# Altium schematic sheet XiBank_V1.0.SchDoc
size A4
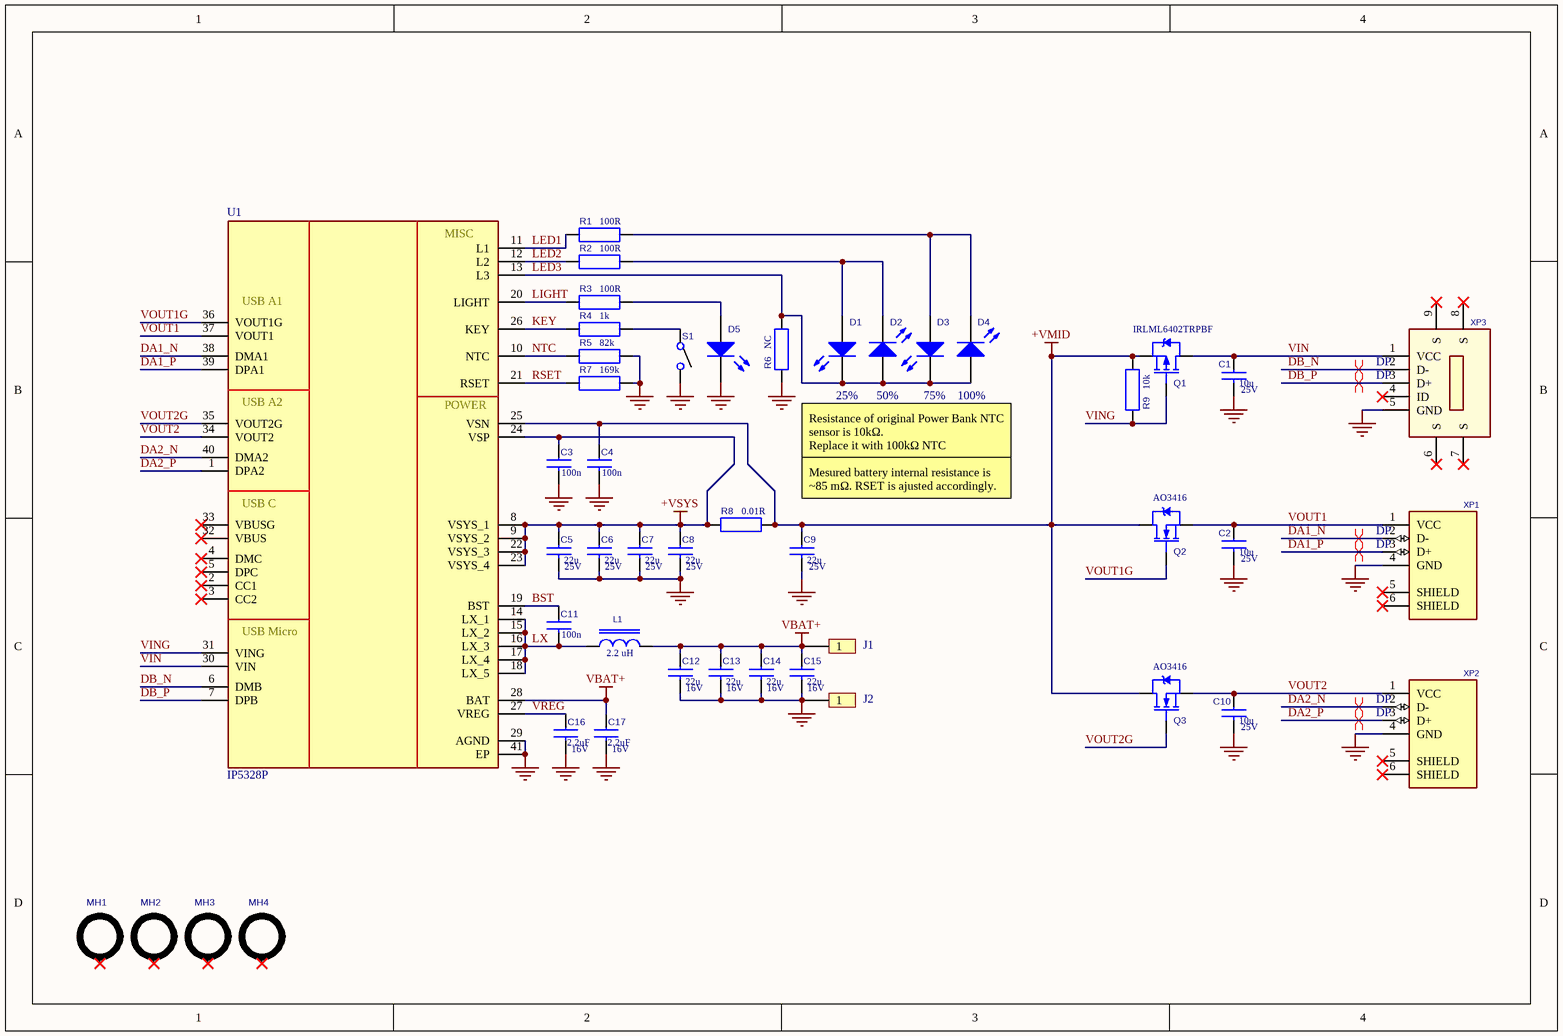
[diagram p0: XiBank_V1.0.SchDoc]

## Parts
C1  Voltage: 25V  [CC0805]  (hidden comment: 10u)
C2  Voltage: 25V  [CC0805]  (hidden comment: 10u)
C3  100n  [CC0603]
C4  100n  [CC0603]
C5  Voltage: 25V  [CC0805]  (hidden comment: 22u)
C6  Voltage: 25V  [CC0805]  (hidden comment: 22u)
C7  Voltage: 25V  [CC0805]  (hidden comment: 22u)
C8  Voltage: 25V  [CC0805]  (hidden comment: 22u)
C9  Voltage: 25V  [CC0805]  (hidden comment: 22u)
C10  Voltage: 25V  [CC0805]  (hidden comment: 10u)
C11  100n  [CC0603]
C12  Voltage: 16V  [CC0805]  (hidden comment: 22u)
C13  Voltage: 16V  [CC0805]  (hidden comment: 22u)
C14  Voltage: 16V  [CC0805]  (hidden comment: 22u)
C15  Voltage: 16V  [CC0805]  (hidden comment: 22u)
C16  Voltage: 16V  [CC0603]  (hidden comment: 2.2uF)
C17  Voltage: 16V  [CC0603]  (hidden comment: 2.2uF)
D1  LTW-C191DS5  [LED0603]  (value not drawn)
D2  LTW-C191DS5  [LED0603]  (value not drawn)
D3  LTW-C191DS5  [LED0603]  (value not drawn)
D4  LTW-C191DS5  [LED0603]  (value not drawn)
D5  LTW-C191DS5  [LED0603]  (value not drawn)
J1  Header 1pin  [1 Hole]  (value not drawn)  (no BOM)
J2  Header 1pin  [1 Hole]  (value not drawn)  (no BOM)
L1  value 2.2 uH  [HPI1040100]  (hidden comment: HPI1040-2R2)
MH1  MH_3.5_NONPLATED  [MH_3.5_NONPLATED]  (value not drawn)  (no BOM)
MH2  MH_3.5_NONPLATED  [MH_3.5_NONPLATED]  (value not drawn)  (no BOM)
MH3  MH_3.5_NONPLATED  [MH_3.5_NONPLATED]  (value not drawn)  (no BOM)
MH4  MH_3.5_NONPLATED  [MH_3.5_NONPLATED]  (value not drawn)  (no BOM)
Q1  IRLML6402TRPBF  [SOT23-3]
Q2  AO3416  [SOT23-3]
Q3  AO3416  [SOT23-3]
R1  100R  [RC0603]
R2  100R  [RC0603]
R3  100R  [RC0603]
R4  1k  [RC0603]
R5  82k  [RC0603]
R6  NC  [RC0603]
R7  169k  [RC0603]
R8  0.01R  [RC1206]
R9  10k  [RC0603]
S1  (no value)  [SW_LS10N2T_CIT]
U1  IP5328P  [QFN50P600X600X80-41N]
XP1  USB-A Conn  [0480372200]  (value not drawn)
XP2  USB-A Conn  [0480372200]  (value not drawn)
XP3  ZX80-B-5P  [10118194-0001LF]  (value not drawn)

## Nets
+VMID: C4.1 C9.1 Q1.2(S) Q2.3(D) Q3.3(D) R8.2 R9.2 U1.25(VSN)
+VSYS: C3.1 C5.1 C6.1 C7.1 C8.1 R8.1 U1.8(VSYS_1) U1.9(VSYS_2) U1.22(VSYS_3) U1.23(VSYS_4) U1.24(VSP)
GND: C1.2 C2.2 C3.2 C4.2 C5.2 C6.2 C7.2 C8.2 C9.2 C10.2 C12.2 C13.2 C14.2 C15.2 C16.2 C17.2 D5.1(K) J2.1 R5.2 R6.1 R7.2 S1.2 U1.29(AGND) U1.41(EP) XP1.4(GND) XP2.4(GND) XP3.5(GND)
VBAT+: C12.1 C13.1 C14.1 C15.1 C17.1 J1.1 L1.2 U1.28(BAT)
BST: C11.1 U1.19(BST)
DA1_N: U1.38(DMA1) XP1.2(D-)
DA1_P: U1.39(DPA1) XP1.3(D+)
DA2_N: U1.40(DMA2) XP2.2(D-)
DA2_P: U1.1(DPA2) XP2.3(D+)
DB_N: U1.6(DMB) XP3.2(D-)
DB_P: U1.7(DPB) XP3.3(D+)
KEY: R4.1 U1.26(KEY)
LED1: R1.1 U1.11(L1)
LED2: R2.1 U1.12(L2)
LED3: D1.1(K) D2.2(A) D3.1(K) D4.2(A) R6.2 U1.13(L3)
LIGHT: R3.1 U1.20(LIGHT)
LX: C11.2 L1.1 U1.14(LX_1) U1.15(LX_2) U1.16(LX_3) U1.17(LX_4) U1.18(LX_5)
NTC: R5.1 U1.10(NTC)
RSET: R7.1 U1.21(RSET)
VIN: C1.1 Q1.3(D) U1.30(VIN) XP3.1(VCC)
VING: Q1.1(G) R9.1 U1.31(VING)
VOUT1: C2.1 Q2.2(S) U1.37(VOUT1) XP1.1(VCC)
VOUT1G: Q2.1(G) U1.36(VOUT1G)
VOUT2: C10.1 Q3.2(S) U1.34(VOUT2) XP2.1(VCC)
VOUT2G: Q3.1(G) U1.35(VOUT2G)
VREG: C16.1 U1.27(VREG)
NetD1_2: D1.2(A) D2.1(K) R2.2
NetD3_2: D3.2(A) D4.1(K) R1.2
NetD5_2: D5.2(A) R3.2
NetR4_2: R4.2 S1.1

Not connected (* = marked no-connect by the designer): MH1 0*; MH2 0*; MH3 0*; MH4 0*; U1 2(CC1)* 3(CC2)* 4(DMC)* 5(DPC)* 32(VBUS)* 33(VBUSG)*; XP1 5(SHIELD)* 6(SHIELD)*; XP2 5(SHIELD)* 6(SHIELD)*; XP3 4(ID)* 6(S)* 7(S)* 8(S)* 9(S)*

## Layout directives
differential pair; ClassDiffPair: DP: DA1_N, DA1_P, DA2_N, DA2_P, DB_N, DB_P

## Notes on the sheet
- 25%
- 50%
- 75%
- 100%
- Resistance of original Power Bank NTC sensor is 10kΩ.
  Replace it with 100kΩ NTC
- Mesured battery internal resistance is
  ~85 mΩ. RSET is ajusted accordingly.
- Title:
- Number:
- Date:
- Time:
- Revision:
- Sheet
- of
- Drawn by :
- Checked by :
- Approved by :
- Variant:
- Black Nova. All Right Reserved - Copyright 2022
- (in symbol IP5328P) MISC; USB A1; USB A2; POWER; USB C; USB Micro

## Library data of the parts
C1 C2 C10 = CC0805K-X7R-10V0-10U: 10 µF ±10% 25V Ceramic Capacitor X5R 0805 (2012 Metric); Manufacturer: Samsung Electro-Mechanics; Manufacturer Part Number: CL21A106KAYNNNE; Pb Free: Yes; Case: 0805; Value: 10u; Tolerance: 10%; Temperature: -55 - +85 C; Material: X5R; Component Type: Standard; ComponentLink2Description: Datasheet; ComponentLink2URL: http://www.yageo.com/pdf/UPY-GPHC_X7R_6.3V-to-50V_3.pdf
C3 C4 C11 = CC0603K-X7R-50V0-100N: 0.1 µF ±10% 50V Ceramic Capacitor X7R 0603 (1608 Metric); Manufacturer: Samsung Electro-Mechanics; Manufacturer Part Number: CL10B104KB8NNNC; Pb Free: Yes; Case: 0603; Value: 100n; Voltage: 50V; Tolerance: 10%; Temperature: -55 - +125 C; Material: X7R; Component Type: Standard; ComponentLink2Description: Datasheet
  C3 C4: ComponentLink2URL: http://www.yageo.com/pdf/UPY-GPHC_X7R_6.3V-to-50V_3.pdf
  C11: ComponentLink2URL: https://media.digikey.com/pdf/Data%20Sheets/Samsung%20PDFs/CL10B104KB8NNNC_Spec.pdf
C5-C9 = CC0805K-X7R-10V0-10U: 22 µF ±20% 25V Ceramic Capacitor X5R 0805 (2012 Metric); Manufacturer: Samsung Electro-Mechanics; Manufacturer Part Number: CL21A226MAYNNNE; Tolerance: 10%; Pb Free: Yes; Case: 0805; Value: 22u; Temperature: -55 - +85 C; Material: X5R; Component Type: Standard; ComponentLink2Description: Datasheet
  C5-C7 C9: ComponentLink2URL: http://www.yageo.com/pdf/UPY-GPHC_X7R_6.3V-to-50V_3.pdf
  C8: ComponentLink2URL: https://media.digikey.com/pdf/Data%20Sheets/Samsung%20PDFs/CL21A226MAYNNNE_Spec.pdf
C12-C15 = CC0805K-X7R-10V0-10U: 22 µF ±20% 16V Ceramic Capacitor X5R 0805 (2012 Metric); Manufacturer: Samsung Electro-Mechanics; Manufacturer Part Number: CL21A226MOCLRNC; Tolerance: 10%; Pb Free: Yes; Case: 0805; Value: 22u; Temperature: -55 - +125 C; Material: X5R; Component Type: Standard; ComponentLink2Description: Datasheet
  C12 C13 C15: ComponentLink2URL: http://www.yageo.com/pdf/UPY-GPHC_X7R_6.3V-to-50V_3.pdf
  C14: ComponentLink2URL: https://media.digikey.com/pdf/Data%20Sheets/Samsung%20PDFs/CL21A226MOCLRNC_Spec.pdf
C16 C17 = CC0603K-X7R-50V0-100N: 2.2 µF ±10% 16V Ceramic Capacitor X5R 0603 (1608 Metric); Manufacturer: Samsung Electro-Mechanics; Manufacturer Part Number: CL10A225KO8NNNC; Pb Free: Yes; Case: 0603; Value: 2.2uF; Tolerance: 10%; Temperature: -55 - +85 C; Material: X5R; Component Type: Standard; ComponentLink2Description: Datasheet
  C16: ComponentLink2URL: http://www.yageo.com/pdf/UPY-GPHC_X7R_6.3V-to-50V_3.pdf
  C17: ComponentLink2URL: https://media.digikey.com/pdf/Data%20Sheets/Samsung%20PDFs/CL10A225KO8NNNC_Spec.pdf
D1-D5 = TLMY1000-GS08: White LED Indication - Discrete 2.93V 0603 (1608 Metric); Manufacturer: Lite-On Inc.; Current: 5mA; Color: White; Voltage: 2.93V; Manufacturer Part Number: LTW-C191DS5; Component Type: Standard; Case: LED0603; ComponentLink2Description: Datasheet
  D1 D3 D4: ComponentLink2URL: http://www.vishay.com/docs/83172/tlmo1000.pdf
  D5: ComponentLink2URL: https://optoelectronics.liteon.com/upload/download/DS22-2006-062/LTW-C191DS5.PDF
J1 J2 = HEADER_2.54_THR_1x1P_MV: THRU header 1pins, MALE, Vertical, 2.54mm pitch; Manufacturer Part Number: TSW-101-07-L-S; Pins number: 1; Pb Free: Yes; Part Number: HEADER_2.54_THR_1x1P_MV; Temperature: -40 - +105 C; Component Type: Standard; Case: HEADER_2.54_THR_1x1P_MV; ComponentLink2Description: Datasheet; ComponentLink2URL: http://suddendocs.samtec.com/catalog_english/tsw_th.pdf; Published: 02-Jan-12; Publisher: dlitvinenko; STATUS: CHECKED
L1 = PSDB1005NT681: SMD Power Inductor, 2.2uH, 12A, 6.5mΩ; Manufacturer: FERROCORE; Tolerance: 20%; Pb Free: Yes; Part Number: HPI1040-2R2; DC Current: 12A; DC Resistance: 6.5mΩ; Temperature: -55...125°C; Manufacturer Part Number: HPI1040-2R2; Component Type: Standard; Case: 10x10x3.8mm; ComponentLink2Description: Datasheet; ComponentLink2URL: http://www.viking.tw/product/PSDB.pdf; Published: 06.04.2014; Publisher: dlegkobyt; STATUS: CHECKED
MH1-MH4 = MH_3.5_NONPLATED: Mounting hole misc, non plated; Part Number: MH_3.5_NONPLATED
Q1 = IRLML6402: P-Channel 20 V 3.7A (Ta) 1.3W (Ta) Surface Mount Micro3™/SOT-23; Manufacturer: Infineon Technologies; Analogs: AO3401A, AO3415, AO3407A; Current: -3.7A; Voltage CEO: -20V; Pb Free: Yes; Marking: E6RRA; Temperature: -50 - +150 C; Manufacturer Part Number: IRLML6402TRPBF; Component Type: Standard; Case: SOT23-3; ComponentLink2Description: Datasheet; ComponentLink2URL: https://www.infineon.com/dgdl/irlml6402pbf.pdf?fileId=5546d462533600a401535668d5c2263c; Parameter 1: *
Q2 Q3 = IRLML2502GPbF: N-Channel 20 V 6.5A (Ta) 1.4W (Ta) Surface Mount SOT-23-3; Manufacturer: Alpha & Omega Semiconductor Inc.; Analogs: DMN3404L; Voltage CEO: 20V; Pb Free: Yes; Current: 6.5A; Temperature: -50 - +150 C; Manufacturer Part Number: AO3416; Component Type: Standard; Case: SOT23-3; ComponentLink2Description: Datasheet; Parameter 1: *
  Q2: ComponentLink2URL: https://media.digikey.com/pdf/Data%20Sheets/Alpha%20&%20Omega/AO3416.pdf
  Q3: ComponentLink2URL: http://www.irf.com/product-info/datasheets/data/irlml2502gpbf.pdf
R1-R3 = RC0603F-100R: 100 ±1% 0.1W, 1/10W Chip Resistor 0603 (1608 Metric) Moisture Resistant Thick Film; Manufacturer: YAGEO; Manufacturer Part Number: RC0603FR-07100RL; Voltage: 50V; Pb Free: Yes; Case: 0603; Value: 100R; Power: 1/10W; Tolerance: 1%; Temperature: -55 - +155 C; Component Type: Standard; ComponentLink2Description: Datasheet; ComponentLink2URL: http://www.yageo.com/pdf/PYu-RC0603_51_RoHS_L_4.pdf
R4 = RC0603F-1K: 1k ±1% 0.1W, 1/10W Chip Resistor 0603 (1608 Metric) Moisture Resistant Thick Film; Manufacturer: YAGEO; Manufacturer Part Number: RC0603FR-071KL; Voltage: 50V; Pb Free: Yes; Case: 0603; Value: 1k; Power: 1/10W; Tolerance: 1%; Temperature: -55 - +155 C; Component Type: Standard; ComponentLink2Description: Datasheet; ComponentLink2URL: http://www.yageo.com/pdf/PYu-RC0603_51_RoHS_L_4.pdf
R5 = RC0603F-82K: 82 kOhms ±1% 0.1W, 1/10W Chip Resistor 0603 (1608 Metric) Moisture Resistant Thick Film; Manufacturer: YAGEO; Manufacturer Part Number: RC0603FR-0782KL; Voltage: 50V; Pb Free: Yes; Case: 0603; Value: 82k; Power: 1/10W; Tolerance: 1%; Temperature: -55 - +155 C; Component Type: Standard; ComponentLink2Description: Datasheet; ComponentLink2URL: https://www.yageo.com/upload/media/product/productsearch/datasheet/rchip/PYu-RC_Group_51_RoHS_L_11.pdf
R6 = RC0603F-200K: 200k ±1% 0.1W, 1/10W Chip Resistor 0603 (1608 Metric) Moisture Resistant Thick Film; Manufacturer: YAGEO; Manufacturer Part Number: RC0603FR-07200KL; Voltage: 50V; Pb Free: Yes; Case: 0603; Value: NC; Power: 1/10W; Tolerance: 1%; Temperature: -55 - +155 C; Component Type: Standard; ComponentLink2Description: Datasheet; ComponentLink2URL: http://www.yageo.com/pdf/PYu-RC0603_51_RoHS_L_4.pdf
R7 = RC0603F-200K: 169k ±1% 0.1W, 1/10W Chip Resistor 0603 (1608 Metric) Moisture Resistant Thick Film; Manufacturer: YAGEO; Manufacturer Part Number: RC0603FR-07169KL; Voltage: 50V; Pb Free: Yes; Case: 0603; Value: 169k; Power: 1/10W; Tolerance: 1%; Temperature: -55 - +155 C; Component Type: Standard; ComponentLink2Description: Datasheet; ComponentLink2URL: http://www.yageo.com/pdf/PYu-RC0603_51_RoHS_L_4.pdf
R8 = RC1206F-0R01: 10 mOhms ±1% 0.25W, 1/4W Chip Resistor 1206 (3216 Metric) Automotive AEC-Q200, Current Sense, Moisture Resistant Thick Film; Manufacturer: YAGEO; Manufacturer Part Number: RL1206FR-070R01L; Voltage: 200V; Pb Free: Yes; Case: 1206; Value: 0.01R; Power: 1/4W; Tolerance: 1%; Temperature: -55 - +155 C; Component Type: Standard; ComponentLink2Description: Datasheet; ComponentLink2URL: https://www.yageo.com/upload/media/product/productsearch/datasheet/rchip/PYu-RL_Group_521_RoHS_L_2.pdf
R9 = RC0603F-10K: 10k ±1% 0.1W, 1/10W Chip Resistor 0603 (1608 Metric) Moisture Resistant Thick Film; Manufacturer: YAGEO; Manufacturer Part Number: RC0603FR-0710KL; Voltage: 50V; Pb Free: Yes; Case: 0603; Value: 10k; Power: 1/10W; Tolerance: 1%; Temperature: -55 - +155 C; Component Type: Standard; ComponentLink2Description: Datasheet; ComponentLink2URL: http://www.yageo.com/pdf/PYu-RC0603_51_RoHS_L_4.pdf
S1 = LS10N2T: Tactile Switch SPST-NO Side Actuated Surface Mount, Right Angle; Manufacturer: Citizen; C: Copyright (C) 2021 Accelerated Designs. All rights reserved; Copyright: Copyright (C) 2022 Ultra Librarian. All rights reserved.; Manufacturer Part Number: LS10N2T; Digi-Key_Part_Number_1: 1642-1308-2-ND; Digi-Key_Part_Number_2: 1642-1308-1-ND; Digi-Key_Part_Number_3: 1642-1308-6-ND
U1 = IP5328P: Fully-Integrated Bi-directional PD3.0 and Fast Charge Power Bank SOC with Multiple Input and Output Ports; Manufacturer: INJOINIC Technology; Datasheet Link: https://datasheetspdf.com/pdf-file/1261761/Injoinic/IP5328P/1; Height: 0.8mm; Manufacturer Part Number: IP5328P
XP1 XP2 = 0480372200: USB-A (USB TYPE-A) USB 2.0 Plug Connector 4 Position Surface Mount, Right Angle; Manufacturer: NULL; Pins number: 4; Pb Free: Yes; Temperature: -20 - +85 C; Manufacturer Part Number: NULL; Component Type: Standard; Case: USB TYPE-A; ComponentLink2Description: Datasheet
  XP2: ComponentLink2URL: https://www.molex.com/pdm_docs/sd/480372200_sd.pdf
XP3 = 10118194-0001LF: Micro USB B Right Angled  Socket, SMD; Manufacturer: FCI; Pins number: 5; Pb Free: Yes; Temperature: -25 - +85 C; Manufacturer Part Number: 10118194-0001LF; Component Type: Standard; Case: 10118194-0001LF; ComponentLink2Description: Datasheet; ComponentLink2URL: http://portal.fciconnect.com/Comergent//fci/drawing/10118194.pdf